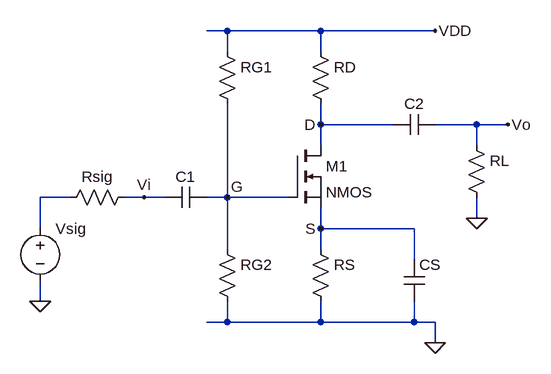
[diagram p0: schematic nmos.asc]
nmos.asc, the LTspice schematic file:
Version 4
SHEET 1 880 680
WIRE 368 -144 336 -144
WIRE 512 -144 368 -144
WIRE 688 -144 512 -144
WIRE 368 -112 368 -144
WIRE 512 -112 512 -144
WIRE 512 0 512 -32
WIRE 624 0 512 0
WIRE 752 0 688 0
WIRE 800 0 752 0
WIRE 512 32 512 0
WIRE 752 32 752 0
WIRE 128 112 80 112
WIRE 240 112 208 112
WIRE 272 112 240 112
WIRE 368 112 368 -32
WIRE 368 112 336 112
WIRE 464 112 368 112
WIRE 752 144 752 112
WIRE 80 160 80 112
WIRE 512 160 512 128
WIRE 656 160 512 160
WIRE 368 192 368 112
WIRE 512 192 512 160
WIRE 656 208 656 160
WIRE 80 272 80 240
WIRE 368 304 368 272
WIRE 368 304 336 304
WIRE 512 304 512 272
WIRE 512 304 368 304
WIRE 656 304 656 272
WIRE 656 304 512 304
WIRE 688 304 656 304
WIRE 688 336 688 304
FLAG 80 272 0
FLAG 240 112 Vi
FLAG 688 -144 VDD
FLAG 688 336 0
FLAG 368 112 G
FLAG 512 0 D
FLAG 512 160 S
FLAG 752 144 0
FLAG 800 0 Vo
SYMBOL voltage 80 144 R0
WINDOW 3 24 96 Invisible 2
SYMATTR InstName Vsig
SYMBOL res 224 96 R90
WINDOW 0 0 56 VBottom 2
WINDOW 3 32 56 Invisible 2
SYMATTR InstName Rsig
SYMBOL cap 336 96 R90
WINDOW 0 0 32 VBottom 2
WINDOW 3 32 32 Invisible 2
SYMATTR InstName C1
SYMBOL res 352 176 R0
WINDOW 3 36 76 Invisible 2
SYMATTR InstName RG2
SYMBOL res 352 -128 R0
WINDOW 3 36 76 Invisible 2
SYMATTR InstName RG1
SYMBOL nmos 464 32 R0
SYMATTR InstName M1
SYMBOL res 496 -128 R0
WINDOW 3 36 76 Invisible 2
SYMATTR InstName RD
SYMBOL res 496 176 R0
WINDOW 3 36 76 Invisible 2
SYMATTR InstName RS
SYMBOL cap 688 -16 R90
WINDOW 0 0 32 VBottom 2
WINDOW 3 32 32 Invisible 2
SYMATTR InstName C2
SYMBOL cap 640 208 R0
WINDOW 3 24 56 Invisible 2
SYMATTR InstName CS
SYMBOL res 736 16 R0
WINDOW 3 36 76 Invisible 2
SYMATTR InstName RL

The netlist it stands for:
* nmos.asc
Vsig N001 0 V
Rsig Vi N001 R
C1 G Vi C
RG2 G 0 R
RG1 VDD G R
M1 D G S S NMOS
RD VDD D R
RS S 0 R
C2 Vo D C
CS S 0 C
RL Vo 0 R
.model NMOS NMOS
.model PMOS PMOS
.lib standard.mos
.backanno
.end